# Altium schematic sheet LoRa.SchDoc
size A3
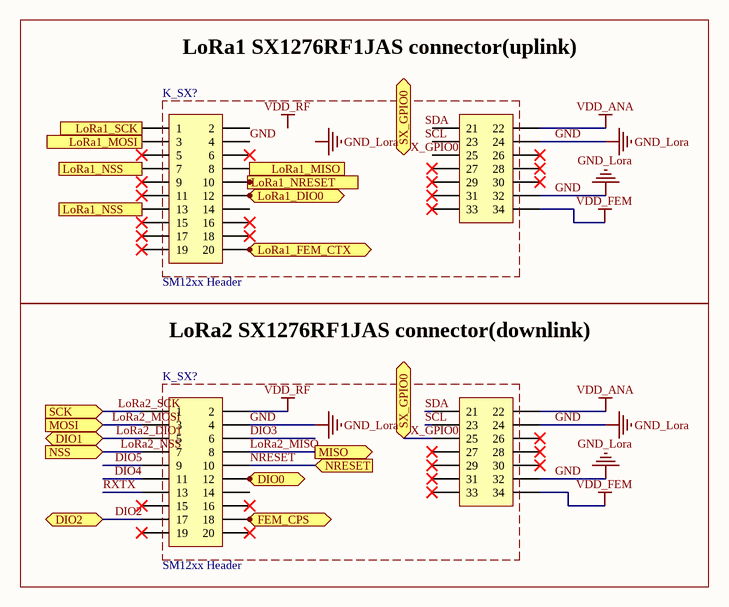
[diagram p0: LoRa.SchDoc]

## Parts
(Parts that share a designator on the sheet are numbered #1, #2 ... from top to bottom, then left to right.)
K_SX?#1  SM12xx Header  [HDR34 Header]
K_SX?#2  SM12xx Header  [HDR34 Header]

## Blocks framed on the sheet
LoRa1 SX1276RF1JAS connector(uplink): K_SX?#1
LoRa2 SX1276RF1JAS connector(downlink): K_SX?#2

## Ports
DIO0 (bidir), DIO1 (bidir), DIO2 (bidir), FEM_CPS (bidir), LoRa1_DIO0 (bidir), LoRa1_FEM_CTX (bidir), LoRa1_MISO (out), LoRa1_MOSI (in), LoRa1_NRESET (in), LoRa1_NSS (in), LoRa1_SCK (in), MISO (out), MOSI (in), NRESET (in), NSS (in), SCK (in), SX_GPIO0 (bidir)

## Nets
GND: K_SX?#1.4 K_SX?#1.24 K_SX?#1.32 K_SX?#2.4 K_SX?#2.24 K_SX?#2.32  [also labelled GND_Lora]
VDD_ANA: K_SX?#1.22 K_SX?#2.22
VDD_FEM: K_SX?#1.34 K_SX?#2.34
VDD_RF: K_SX?#2.2
DIO0: K_SX?#2.12 ; port DIO0
DIO2: K_SX?#2.17 ; port DIO2
DIO3: K_SX?#2.6
DIO4: K_SX?#2.11
DIO5: K_SX?#2.9
FEM_CPS: K_SX?#2.18 ; port FEM_CPS
LoRa1_FEM_CTX: K_SX?#1.20 ; port LoRa1_FEM_CTX
LoRa1_MISO: K_SX?#1.8 ; port LoRa1_MISO
LoRa1_MOSI: K_SX?#1.3 ; port LoRa1_MOSI
LoRa1_NSS: K_SX?#1.7 K_SX?#1.13 ; port LoRa1_NSS
LoRa1_SCK: K_SX?#1.1 ; port LoRa1_SCK
LoRa2_DIO1: K_SX?#2.5 ; port DIO1
LoRa2_MISO: K_SX?#2.8 ; port MISO
LoRa2_MOSI: K_SX?#2.3 ; port MOSI
LoRa2_NSS: K_SX?#2.7 ; port NSS
LoRa2_SCK: K_SX?#2.1 ; port SCK
NRESET: K_SX?#2.10 ; port NRESET
RXTX: K_SX?#2.13
SCL: K_SX?#2.23
SDA: K_SX?#2.21
SX_GPIO0: K_SX?#2.25 ; port SX_GPIO0

Not connected (* = marked no-connect by the designer): K_SX?#1 2 5* 6* 9* 10 11* 12 14 15* 16* 17* 18* 19* 21 23 25 26* 27* 28* 29* 30* 31* 33*; K_SX?#2 14 15* 16* 19* 20* 26* 27* 28* 29* 30* 31* 33*

## Notes on the sheet
- Labels drawn without touching a wire or pin: GND_Lora, SCL, SDA, VDD_RF

## Library data of the parts
K_SX?#1 K_SX?#2 = SM12xx Header: SM12xx Header; 34pins: 2x10pins + 2x7pins; LatestRevisionDate: 24.8.2012; LatestRevisionNote: Re-released for DXP Platform.; Publisher: Altium Limited